# EAGLE design board (EAGLE 9.5.0)
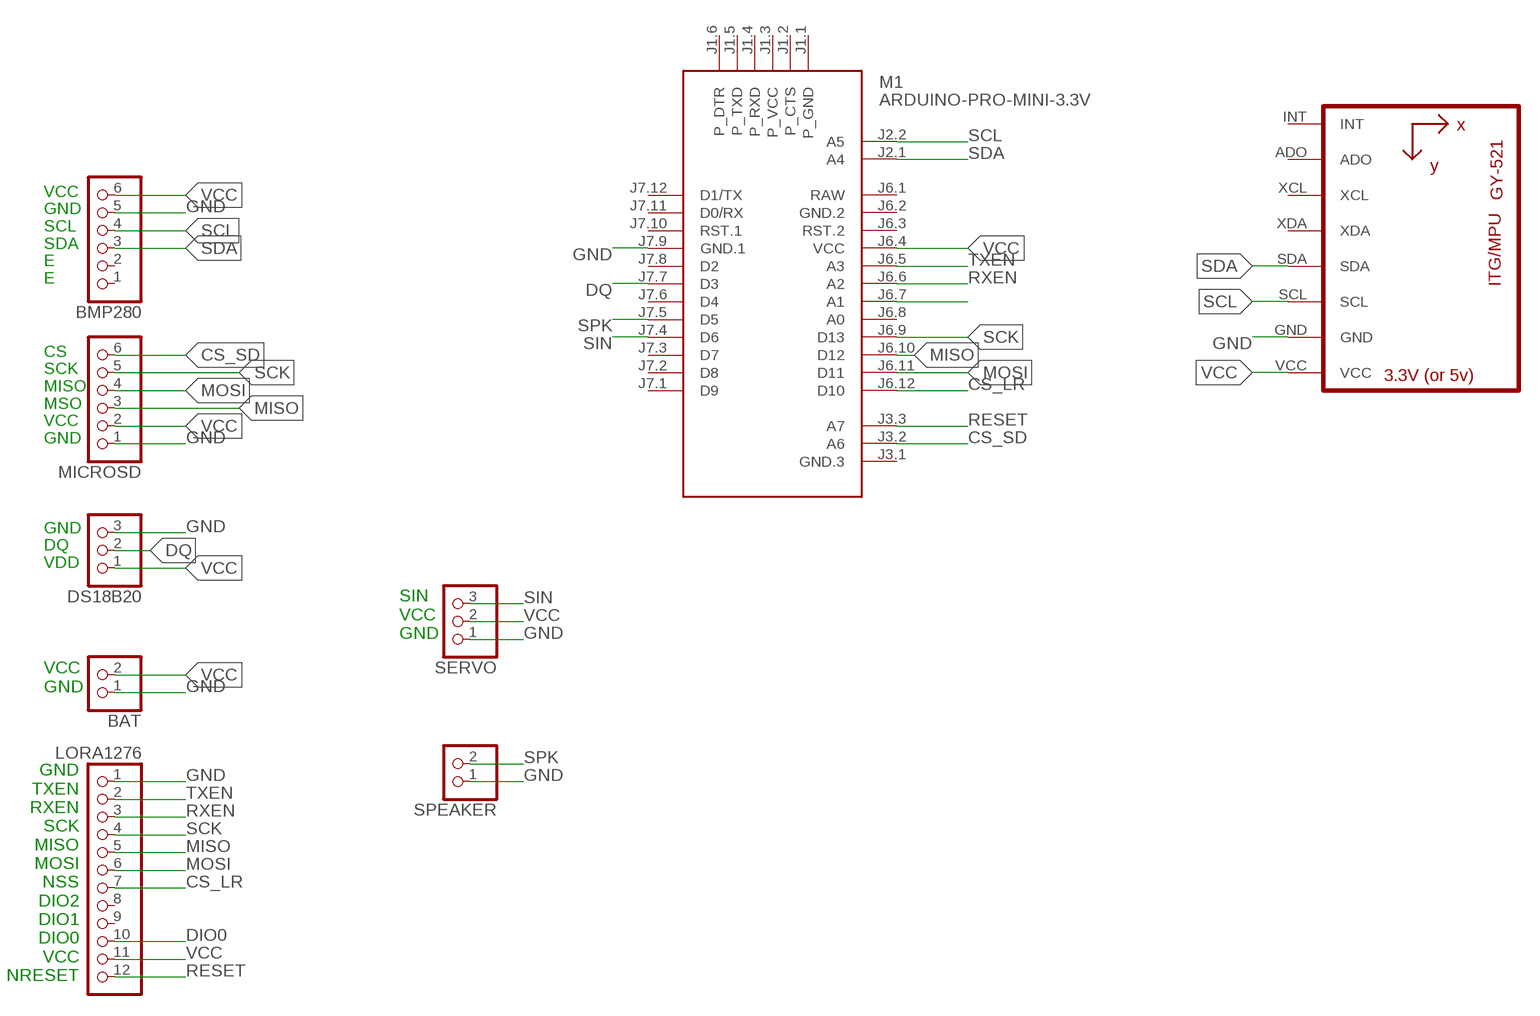
[diagram p0: schematic, sheet 1]

## Parts
BAT  PINHD-1X2  [1X02]
BMP280  PINHD-1X6  [1X06]
DS18B20  PINHD-1X3  [1X03]
LORA1276  PINHD-1X12  [1X12]
M1  ARDUINO-PRO-MINI-3.3V  [ARDUINO-PRO-MINI]
MICROSD  PINHD-1X6  [1X06]
SERVO  PINHD-1X3  [1X03]
SPEAKER  PINHD-1X2  [1X02]
U1  GY-521MPU6050  [GY-521]

## Nets
CS_LR: LORA1276.7 M1.J6.12(D10)
CS_SD: M1.J3.2(A6) MICROSD.6
DIO0: LORA1276.10 M1.J6.7(A1)
DQ: DS18B20.2 M1.J7.7(D3)
GND: BAT.1 BMP280.5 DS18B20.3 LORA1276.1 M1.J7.9(GND.1) MICROSD.1 SERVO.1 SPEAKER.1 U1.GND
MISO: LORA1276.5 M1.J6.10(D12) MICROSD.3
MOSI: LORA1276.6 M1.J6.11(D11) MICROSD.4
RESET: LORA1276.12 M1.J3.3(A7)
RXEN: LORA1276.3 M1.J6.6(A2)
SCK: LORA1276.4 M1.J6.9(D13) MICROSD.5
SCL: BMP280.4 M1.J2.2(A5) U1.SCL
SDA: BMP280.3 M1.J2.1(A4) U1.SDA
SIN: M1.J7.4(D6) SERVO.3
SPK: M1.J7.5(D5) SPEAKER.2
TXEN: LORA1276.2 M1.J6.5(A3)
VCC: BAT.2 BMP280.6 DS18B20.1 LORA1276.11 M1.J6.4(VCC) MICROSD.2 SERVO.2 U1.VCC
Unconnected: BMP280.1 BMP280.2 LORA1276.8 LORA1276.9 M1.J1.1(P_GND) M1.J1.2(P_CTS) M1.J1.3(P_VCC) M1.J1.4(P_RXD) M1.J1.5(P_TXD) M1.J1.6(P_DTR) M1.J3.1(GND.3) M1.J6.3(RST.2) M1.J6.8(A0) M1.J7.1(D9) M1.J7.2(D8) M1.J7.3(D7) M1.J7.6(D4) M1.J7.8(D2) M1.J7.10(RST.1) M1.J7.11(D0/RX) M1.J7.12(D1/TX) U1.ADO U1.INT U1.XCL U1.XDA

## Notes on the sheet
- VCC
  GND
  SCL
  SDA
  E
  E
- CS
  SCK
  MISO
  MSO
  VCC
  GND
- GND
  DQ
  VDD
- SIN
  VCC
  GND
- VCC
  GND
- GND
  TXEN
  RXEN
  SCK
  MISO
  MOSI
  NSS
  DIO2
  DIO1
  DIO0
  VCC
  NRESET

## Power pins joined to a net without a drawn wire
GND.2: M1.J6.2(GND.2)
RAW: M1.J6.1(RAW)

## Library data of the parts
BAT SPEAKER = pinhead:PINHD-1X2: PIN HEADER
BMP280 MICROSD = pinhead:PINHD-1X6: PIN HEADER
DS18B20 SERVO = pinhead:PINHD-1X3: PIN HEADER
LORA1276 = pinhead:PINHD-1X12: PIN HEADER
M1 = diy-modules:ARDUINO-PRO-MINI-*: Arduino Pro Mini and compatible devices More details available here: https://www.arduino.cc/en/Main/ArduinoBoardProMini Click here to find device on ebay.com <http://www.ebay.com/sch/arduino+pro+mini>
U1 = gy-521:GY-521

## Board
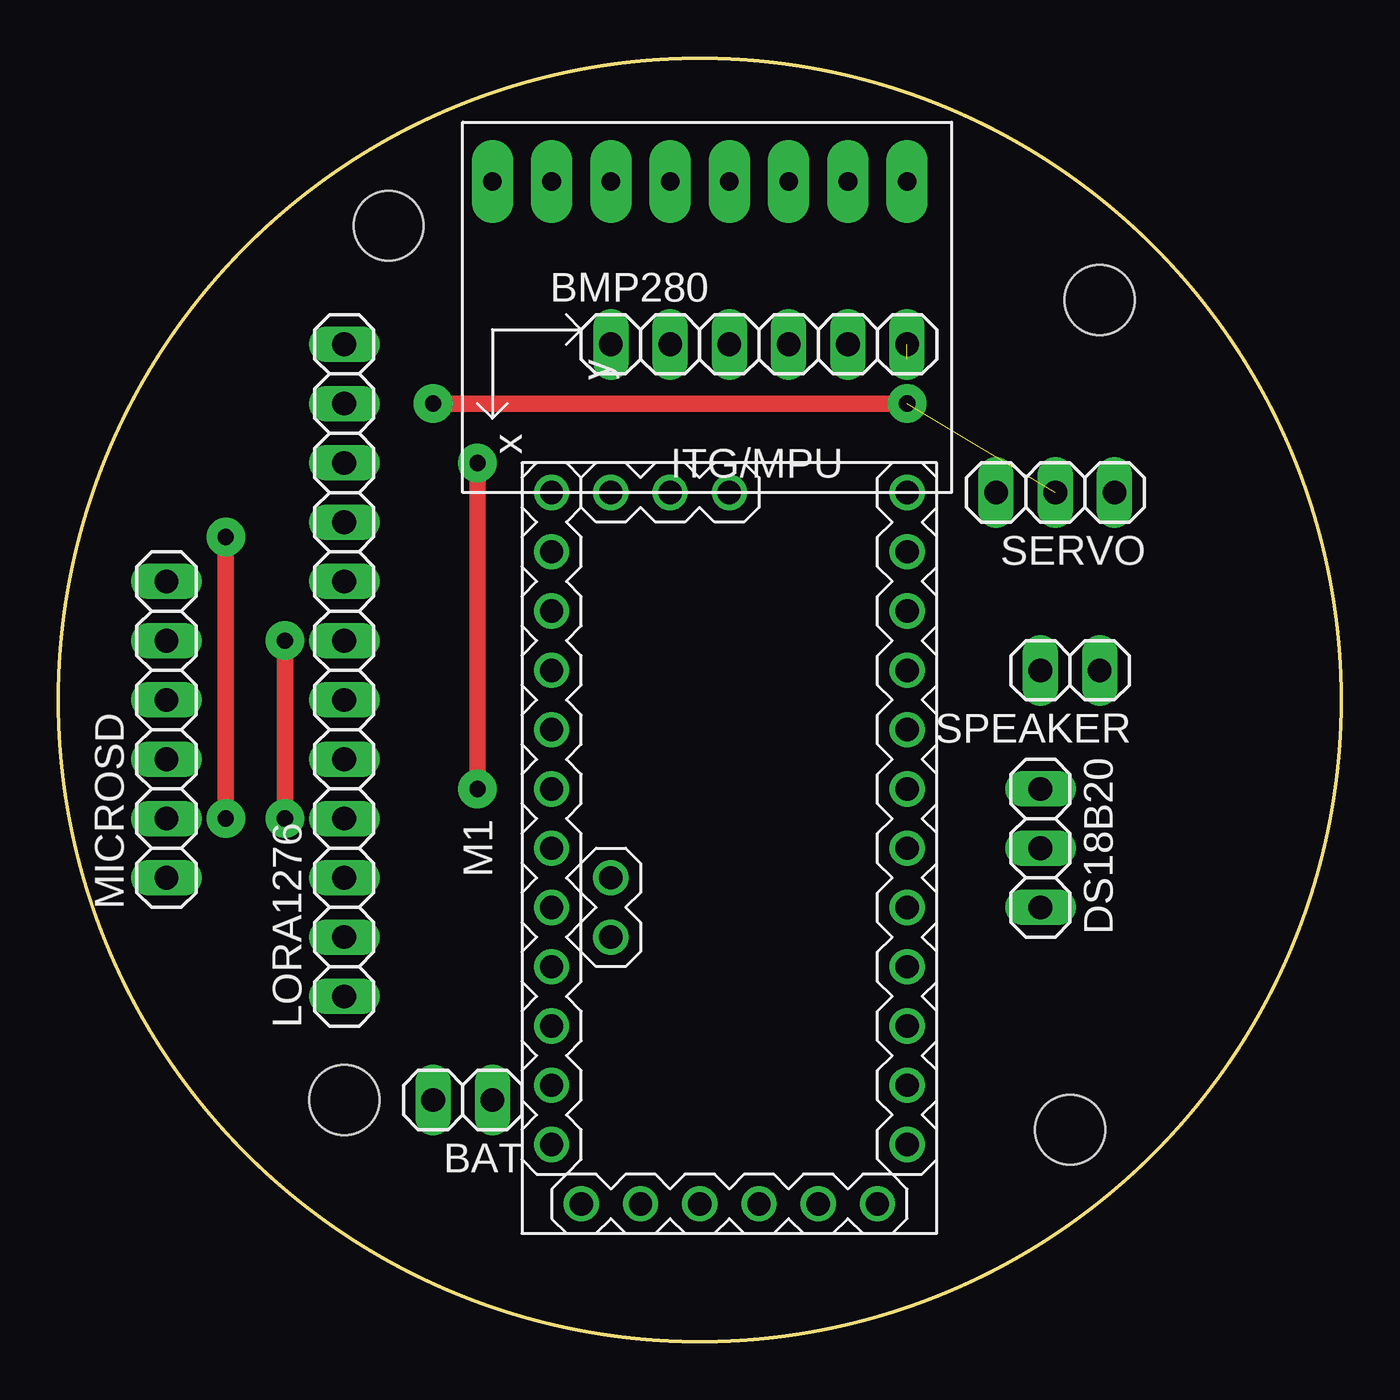
[diagram p1: board, top side]
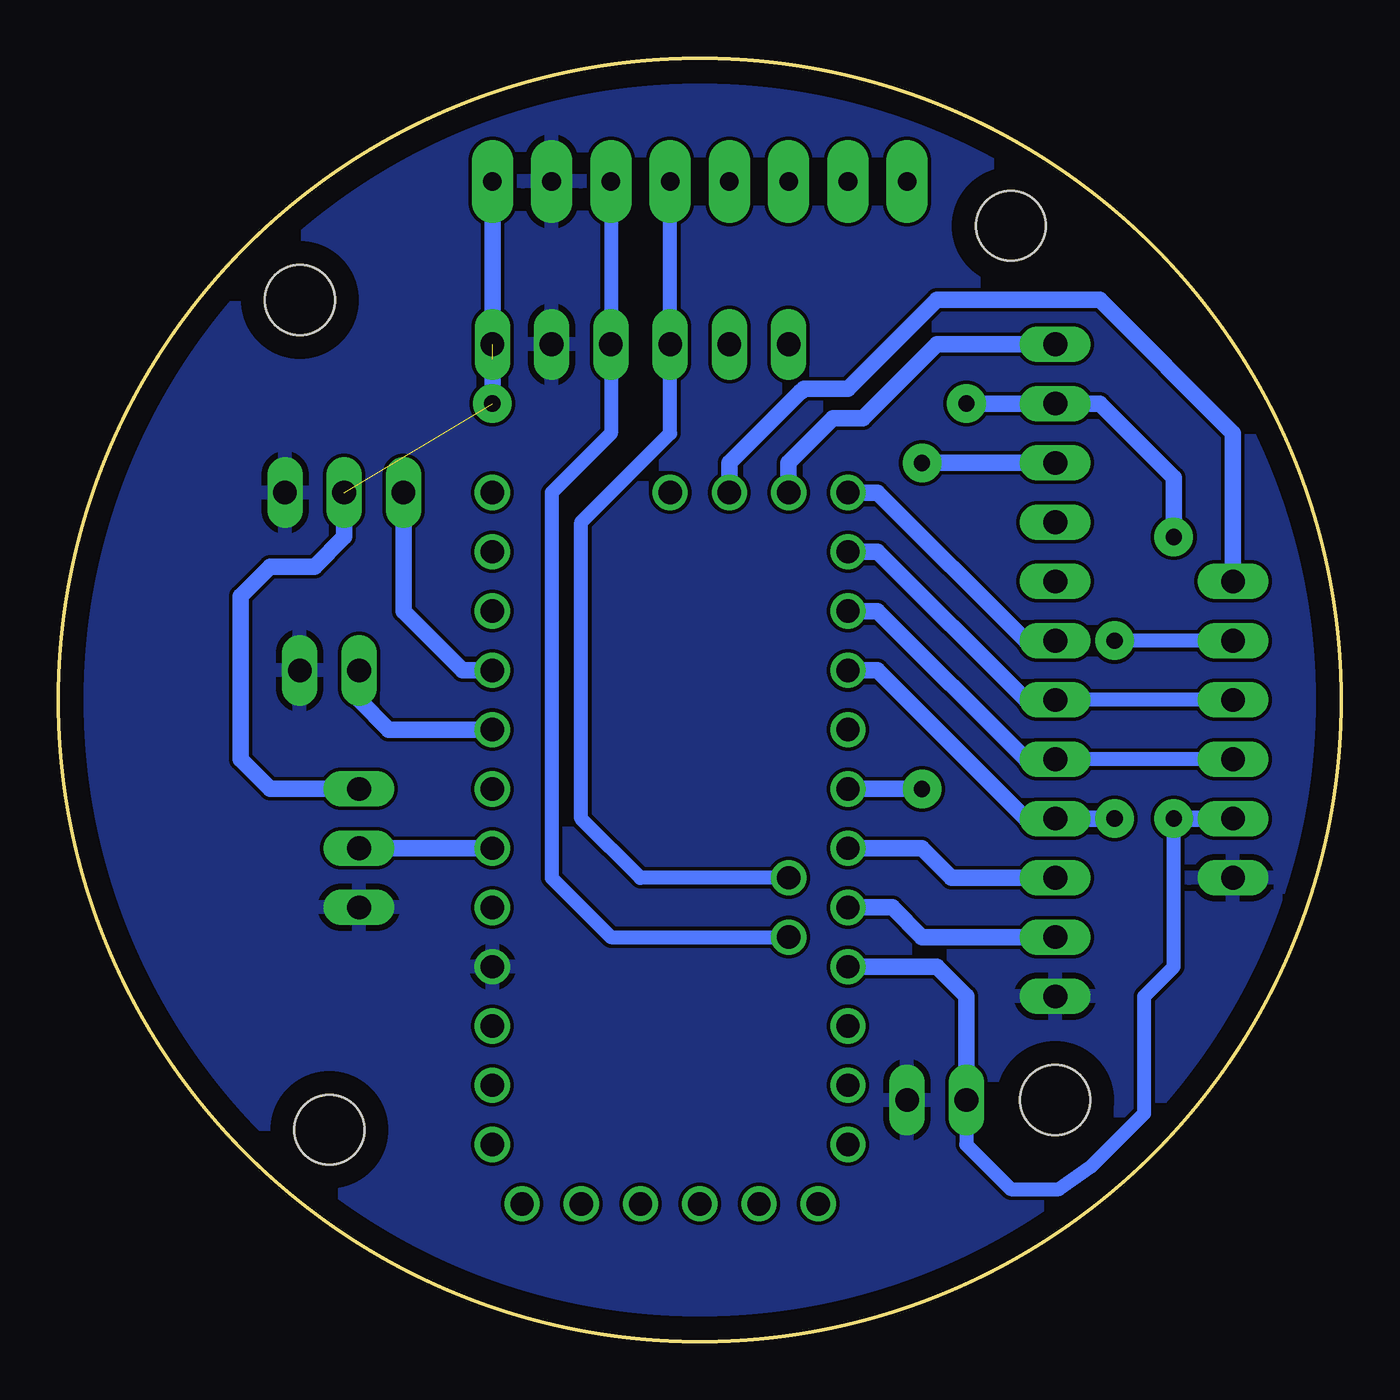
[diagram p2: board, bottom side, seen from below]

Size 54.99 x 54.99 mm. Coordinates in mm from the lower left corner, seen from the top.
Outline: circle at 27.5,27.5 radius 27.5
Copper layers (1*16): Top 0.035mm / dielectric 1.5mm / Bottom 0.035mm
Design rules "default": minimum track width 6mil, minimum drill 0.35mm, track to track 6mil, track to pad 6mil, pad to pad 6mil, via to via 6mil, smd to smd 6mil, copper to edge 40mil, drill to drill 6mil, minimum pad ring 10mil, minimum via ring 8mil, stop-mask expansion 4mil, vias tented up to drill 0mil, thermal gap 10mil
Holes 3 mm at 14.16,47.82 44.64,44.64 43.37,9.08 12.26,10.35

### Footprints (pad centres in the part's own frame; a part is rotated, then mirrored left to right if it is on the bottom)
1X02 = drill 1.016 long: 1 -1.27,0; 2 1.27,0
1X06 = drill 1.016 long: 1 -6.35,0; 2 -3.81,0; 3 -1.27,0; 4 1.27,0; 5 3.81,0; 6 6.35,0
1X03 = drill 1.016 long: 1 -2.54,0; 2 0,0; 3 2.54,0
1X12 = drill 1.016 long: 1 -13.97,0; 2 -11.43,0; 3 -8.89,0; 4 -6.35,0; 5 -3.81,0; 6 -1.27,0; 7 1.27,0; 8 3.81,0; 9 6.35,0; 10 8.89,0; 11 11.43,0; 12 13.97,0
ARDUINO-PRO-MINI = drill 1: J1.1 -15.24,6.35; J1.2 -15.24,3.81; J1.3 -15.24,1.27; J1.4 -15.24,-1.27; J1.5 -15.24,-3.81; J1.6 -15.24,-6.35; J2.1 -1.27,5.08; J2.2 -3.81,5.08; J3.1 15.24,0; J3.2 15.24,2.54; J3.3 15.24,5.08; J6.1 -12.7,7.62; J6.2 -10.16,7.62; J6.3 -7.62,7.62; J6.4 -5.08,7.62; J6.5 -2.54,7.62; J6.6 0,7.62; J6.7 2.54,7.62; J6.8 5.08,7.62; J6.9 7.62,7.62; J6.10 10.16,7.62; J6.11 12.7,7.62; J6.12 15.24,7.62; J7.1 15.24,-7.62; J7.2 12.7,-7.62; J7.3 10.16,-7.62; J7.4 7.62,-7.62; J7.5 5.08,-7.62; J7.6 2.54,-7.62; J7.7 0,-7.62; J7.8 -2.54,-7.62; J7.9 -5.08,-7.62; J7.10 -7.62,-7.62; J7.11 -10.16,-7.62; J7.12 -12.7,-7.62
GY-521 = drill 0.8 pad 1.778 long: ADO -8.89,-6.35; GND -8.89,6.35; INT -8.89,-8.89; SCL -8.89,3.81; SDA -8.89,1.27; VCC -8.89,8.89; XCL -8.89,-3.81; XDA -8.89,-1.27

### Placement (x,y rotation side)
BAT  17.34,10.35 180 top
BMP280  30.04,42.74 0 top
DS18B20  42.1,21.15 270 top
LORA1276  12.26,28.77 90 top
M1  28.77,21.15 90 top
MICROSD  4.64,26.23 90 top
SERVO  42.74,36.39 180 top
SPEAKER  43.37,28.77 180 top
U1  27.5,40.83 270 top

### Tracks (layer width: path | path; a pad name or v marks a point on that pad's centre or on a via)
CS_LR
  Bottom 0.711: LORA1276.7 13.53,30.04 19.88,36.39 M1.J6.12
CS_SD
  Bottom 0.711: MICROSD.6 4.64,38.93 10.35,44.64 17.34,44.64 21.15,40.83 23.03,40.83 23.16,40.7 23.18,40.7 26.23,37.66 M1.J3.2
DIO0  (via drill 0.7 pad 1.65)
  Top 0.711: v17.97,37.66 v17.97,23.69
  Bottom 0.711: LORA1276.10 v17.97,37.66 | v17.97,23.69 M1.J6.7
DQ
  Bottom 0.711: DS18B20.2 M1.J7.7
GND
  pour Bottom: 0.19,-2.98 52.9,-2.98 57.34,1.46 59.25,3.37 59.25,19.88 60.52,21.15 60.52,43.37 60.52,46.55 55.44,51.63 47.18,59.88 44.01,59.88 -11.24,59.88 -15.05,56.07 -15.05,11.62 -0.44,-2.98
MISO
  Bottom 0.61: MICROSD.3 LORA1276.5
  Bottom 0.711: LORA1276.5 13.53,24.96 19.88,31.31 M1.J6.10
MOSI
  Bottom 0.61: MICROSD.4 LORA1276.6
  Bottom 0.711: LORA1276.6 13.53,27.5 19.88,33.85 M1.J6.11
RESET
  Bottom 0.711: M1.J3.3 23.69,37.66 21.78,39.56 20.51,39.56 17.34,42.74 LORA1276.12
RXEN
  Bottom 0.711: M1.J6.6 17.97,21.15 16.7,19.88 LORA1276.3
SCK  (via drill 0.7 pad 1.65)
  Top 0.711: v9.72,30.04 v9.72,22.42
  Bottom 0.61: MICROSD.5 v9.72,30.04
  Bottom 0.711: v9.72,22.42 LORA1276.4 13.53,22.42 19.88,28.77 M1.J6.9
SCL
  Bottom 0.61: M1.J2.2 31.31,17.34 33.85,19.88 33.85,36.39 31.31,38.93 BMP280.4 U1.SCL
SDA
  Bottom 0.61: M1.J2.1 30.04,19.88 32.58,22.42 32.58,35.12 28.77,38.93 BMP280.3 U1.SDA
SIN
  Bottom 0.711: M1.J7.4 37.66,28.77 40.2,31.31 SERVO.3
SPK
  Bottom 0.711: SPEAKER.2 42.1,27.5 40.83,26.23 M1.J7.5
TXEN
  Bottom 0.711: M1.J6.5 19.24,18.61 17.97,17.34 LORA1276.2
VCC  (via drill 0.7 pad 1.65)  (2 unrouted)
  Top 0.152: BAT.2 16.07,9.08
  Top 0.711: v7.18,22.42 v7.18,34.48 | v16.07,40.2 v36.39,40.2
  Bottom 0.61: BAT.2 16.07,8.45 14.16,6.54 12.09,6.54 10.72,7.5 10.38,7.84 10.06,8.16 8.45,9.78 8.45,14.8 7.18,16.07 v7.18,22.42
  Bottom 0.711: MICROSD.2 v7.18,22.42 | v7.18,34.48 7.18,37.02 10.35,40.2 LORA1276.11 v16.07,40.2 | U1.VCC BMP280.6 | v36.39,40.2 36.39,42.1 | BAT.2 16.07,14.8 17.34,16.07 M1.J6.4 | DS18B20.1 45.91,23.69 47.18,24.96 47.18,31.94 45.91,33.21 44.01,33.21 42.74,34.48 SERVO.2